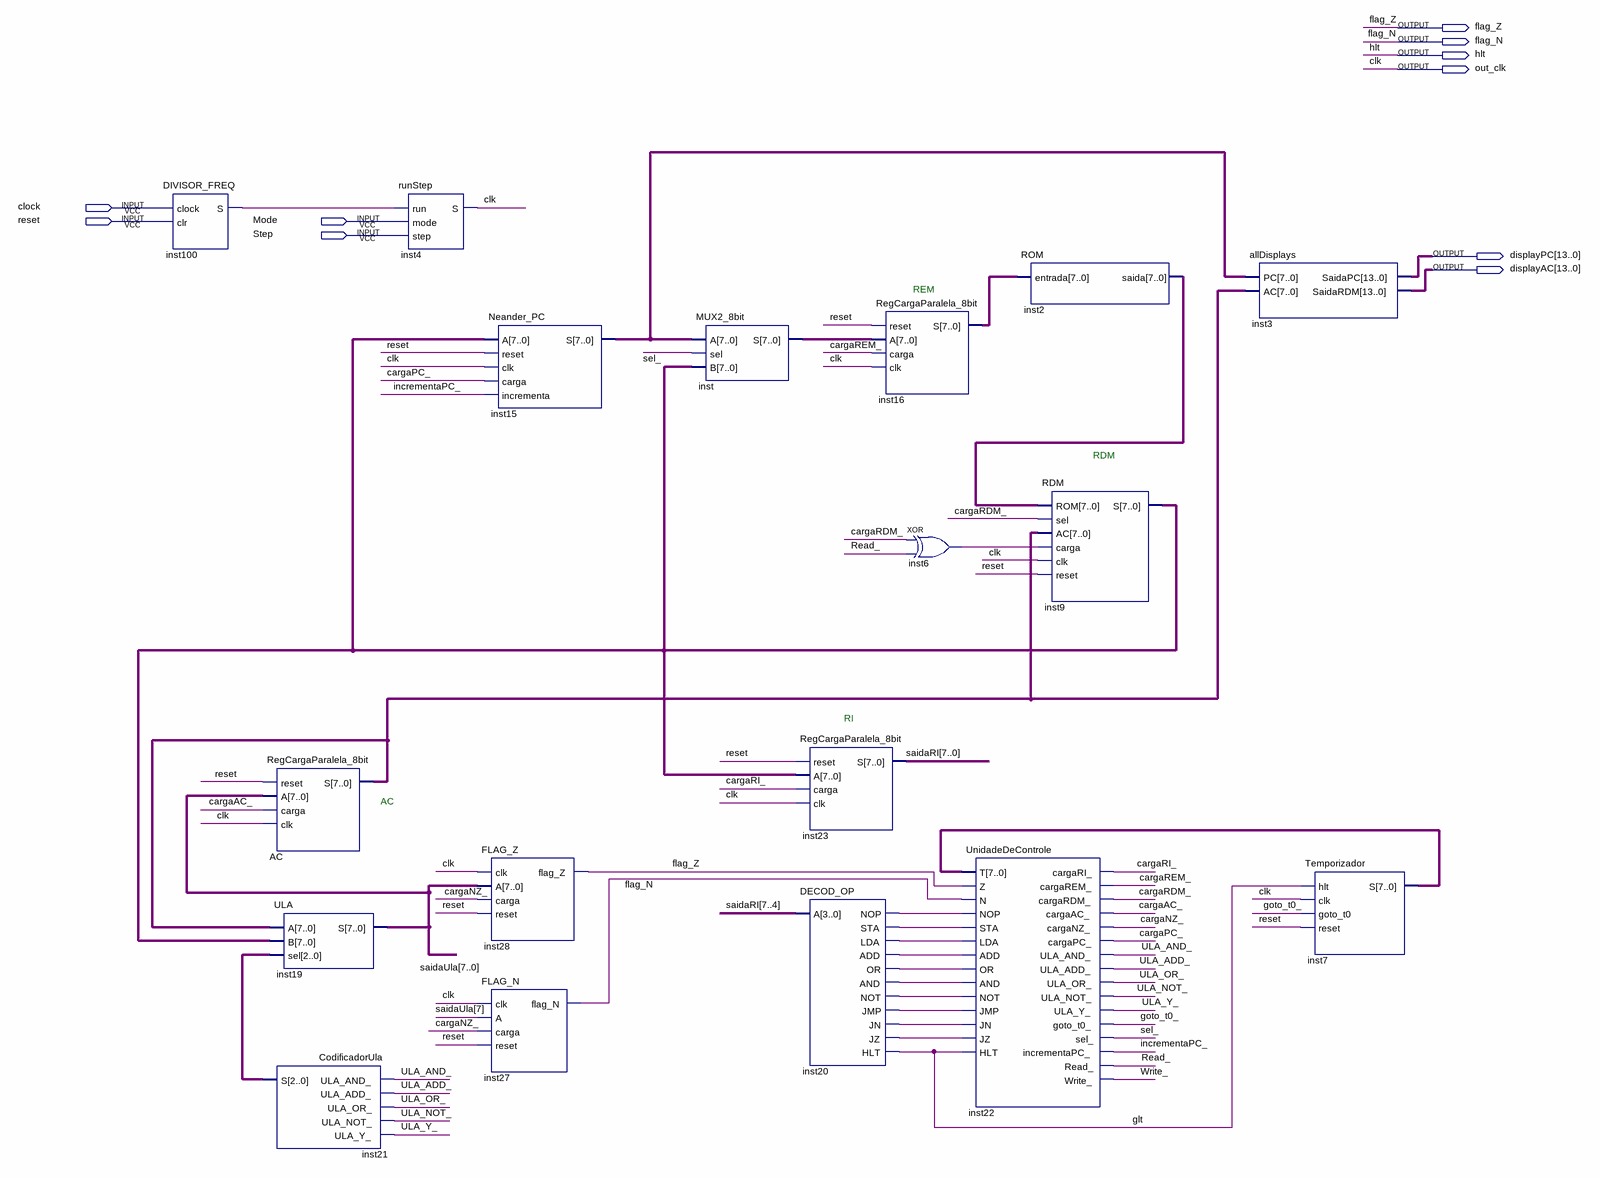
[diagram p0: schematic sheet]
// Quartus schematic Neander.bdf as structural Verilog: 18 symbols, 10 pins
module Neander (
  input  clock,
  input  reset,
  input  Mode,
  input  Step,
  output flag_Z,
  output flag_N,
  output hlt,
  output out_clk,
  output [13:0] displayPC,
  output [13:0] displayAC
);

  wire cargaAC_, cargaNZ_, cargaPC_, cargaRDM_, cargaREM_, cargaRI_, glt, goto_t0_, incrementaPC_, inst6_out,
       inst20_add, inst20_and, inst20_jmp, inst20_jn, inst20_jz, inst20_lda, inst20_nop, inst20_not,
       inst20_or, inst20_sta, inst100_s, Read_, sel_, ULA_ADD_, ULA_AND_, ULA_NOT_, ULA_OR_, ULA_Y_, Write_;
  wire [2:0] inst21_s;
  wire [7:0] AC_s, inst2_saida, inst7_s, inst9_s, inst15_s, inst16_s, inst_s, saidaRI, saidaUla;

  DIVISOR_FREQ inst100 (.clock(clock), .clr(reset), .S(inst100_s));
  RegCargaParalela_8bit AC (.reset(reset), .A(saidaUla), .carga(cargaAC_), .clk(out_clk), .S(AC_s));
  ULA inst19 (.A(AC_s), .B(inst9_s), .sel(inst21_s), .S(saidaUla));
  CodificadorUla inst21 (
    .ULA_AND_(ULA_AND_), .ULA_ADD_(ULA_ADD_), .ULA_OR_(ULA_OR_), .ULA_NOT_(ULA_NOT_), .ULA_Y_(ULA_Y_),
    .S(inst21_s));
  runStep inst4 (.run(inst100_s), .mode(Mode), .step(Step), .S(out_clk));
  Neander_PC inst15 (
    .A(inst9_s), .reset(reset), .clk(out_clk), .carga(cargaPC_), .incrementa(incrementaPC_), .S(inst15_s));
  FLAG_Z inst28 (.clk(out_clk), .A(saidaUla), .carga(cargaNZ_), .reset(reset), .flag_Z(flag_Z));
  FLAG_N inst27 (.clk(out_clk), .A(saidaUla[7]), .carga(cargaNZ_), .reset(reset), .flag_N(flag_N));
  MUX2_8bit inst (.A(inst15_s), .sel(sel_), .B(inst9_s), .S(inst_s));
  RegCargaParalela_8bit inst23 (.reset(reset), .A(inst9_s), .carga(cargaRI_), .clk(out_clk), .S(saidaRI));
  DECOD_OP inst20 (
    .A(saidaRI[7:4]), .NOP(inst20_nop), .STA(inst20_sta), .LDA(inst20_lda), .ADD(inst20_add), .OR(inst20_or),
    .AND(inst20_and), .NOT(inst20_not), .JMP(inst20_jmp), .JN(inst20_jn), .JZ(inst20_jz), .HLT(glt));
  RegCargaParalela_8bit inst16 (.reset(reset), .A(inst_s), .carga(cargaREM_), .clk(out_clk), .S(inst16_s));
  xor inst6 (inst6_out, cargaRDM_, Read_);
  UnidadeDeControle inst22 (
    .T(inst7_s), .Z(flag_Z), .N(flag_N), .NOP(inst20_nop), .STA(inst20_sta), .LDA(inst20_lda),
    .ADD(inst20_add), .OR(inst20_or), .AND(inst20_and), .NOT(inst20_not), .JMP(inst20_jmp), .JN(inst20_jn),
    .JZ(inst20_jz), .HLT(glt), .cargaRI_(cargaRI_), .cargaREM_(cargaREM_), .cargaRDM_(cargaRDM_),
    .cargaAC_(cargaAC_), .cargaNZ_(cargaNZ_), .cargaPC_(cargaPC_), .ULA_AND_(ULA_AND_), .ULA_ADD_(ULA_ADD_),
    .ULA_OR_(ULA_OR_), .ULA_NOT_(ULA_NOT_), .ULA_Y_(ULA_Y_), .goto_t0_(goto_t0_), .sel_(sel_),
    .incrementaPC_(incrementaPC_), .Read_(Read_), .Write_(Write_));
  ROM inst2 (.entrada(inst16_s), .saida(inst2_saida));
  RDM inst9 (
    .ROM(inst2_saida), .sel(cargaRDM_), .AC(AC_s), .carga(inst6_out), .clk(out_clk), .reset(reset),
    .S(inst9_s));
  allDisplays inst3 (.PC(inst15_s), .AC(AC_s), .SaidaPC(displayPC), .SaidaRDM(displayAC));
  Temporizador inst7 (.hlt(glt), .clk(out_clk), .goto_t0(goto_t0_), .reset(reset), .S(inst7_s));

  // Other names for the same wires on the sheet: clk = out_clk

  // Notes on the sheet:
  //   REM
  //   RDM
  //   RI
  //   AC
endmodule
